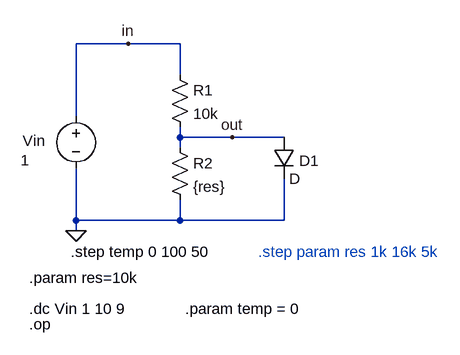
[diagram p0: schematic DC sweep.asc]
DC sweep.asc, the LTspice schematic file:
Version 4
SHEET 1 880 680
WIRE 208 80 128 80
WIRE 288 80 208 80
WIRE 288 128 288 80
WIRE 128 192 128 80
WIRE 288 224 288 208
WIRE 368 224 288 224
WIRE 448 224 368 224
WIRE 288 240 288 224
WIRE 128 352 128 272
WIRE 288 352 288 320
WIRE 288 352 128 352
WIRE 448 352 448 288
WIRE 448 352 288 352
WIRE 128 368 128 352
FLAG 128 368 0
FLAG 368 224 out
FLAG 208 80 in
SYMBOL voltage 128 176 R0
WINDOW 123 0 0 Left 0
WINDOW 39 0 0 Left 0
WINDOW 0 -82 53 Left 2
WINDOW 3 -85 83 Left 2
SYMATTR InstName Vin
SYMATTR Value 1
SYMBOL res 272 112 R0
SYMATTR InstName R1
SYMATTR Value 10k
SYMBOL res 272 224 R0
SYMATTR InstName R2
SYMATTR Value {res}
SYMBOL diode 432 224 R0
WINDOW 0 39 36 Left 2
SYMATTR InstName D1
TEXT 56 488 Left 2 !.dc Vin 1 10 9
TEXT 56 440 Left 2 !.param res=10k
TEXT 120 400 Left 2 !.step temp 0 100 50
TEXT 408 400 Left 2 ;.step param res 1k 16k 5k
TEXT 56 512 Left 2 !.op
TEXT 296 488 Left 2 !.param temp = 0

The netlist it stands for:
* DC sweep.asc
Vin in 0 1
R1 in out 10k
R2 out 0 {res}
D1 out 0 D
.model D D
.lib standard.dio
.dc Vin 1 10 9
.param res=10k
.step temp 0 100 50
* .step param res 1k 16k 5k
.op
.param temp = 0
.backanno
.end

* Results of the author's LTspice run, read from the files saved beside the schematic
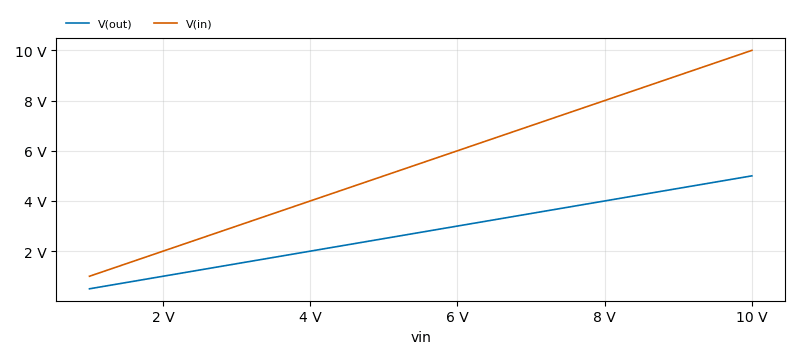
[diagram p1: DC transfer characteristic of DC sweep.asc, plotted from the saved traces]
* DC transfer characteristic, 1 run:
*   V(out): 500 mV at vin=1 V, 5 V at vin=10 V, min 500 mV, max 5 V
*   V(in): 1 V at vin=1 V, 10 V at vin=10 V, min 1 V, max 10 V